# Altium schematic sheet rightinferior.SchDoc
size A
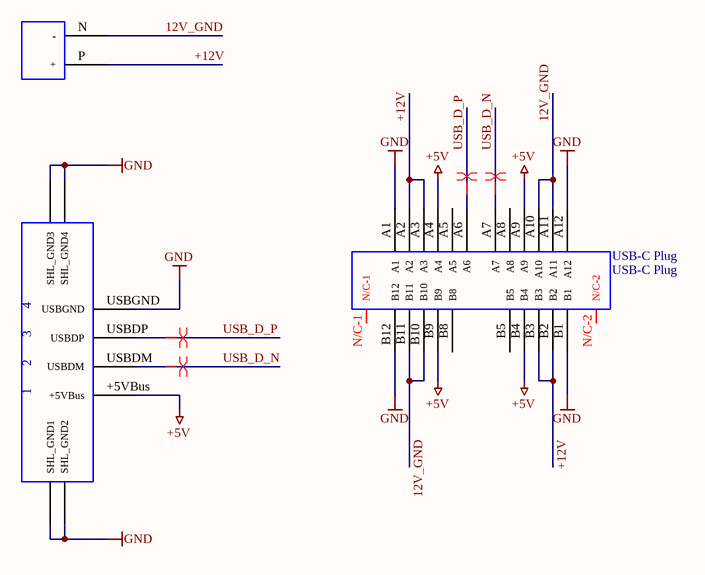
[diagram p0: rightinferior.SchDoc]

## Parts
Screw_Header_-_2_pos  Screw Header - 2 pos  [SCREW HEADER - 2POS]  (value not drawn)
USB-C_Plug  USB-C Plug  [USB C PLUG]
USB_A_Receptacle  USB A Receptacle  [USB A RECEPTACLE]  (value not drawn)

## Nets
+5V: USB-C_Plug.A4 USB-C_Plug.A9 USB-C_Plug.B4 USB-C_Plug.B9 USB_A_Receptacle.+5VBus
GND: USB-C_Plug.A1 USB-C_Plug.A12 USB-C_Plug.B1 USB-C_Plug.B12 USB_A_Receptacle.SHL_GND1 USB_A_Receptacle.SHL_GND2 USB_A_Receptacle.SHL_GND3 USB_A_Receptacle.SHL_GND4 USB_A_Receptacle.USBGND
12V_GND: Screw_Header_-_2_pos.N(-) USB-C_Plug.A10 USB-C_Plug.A11 USB-C_Plug.B10 USB-C_Plug.B11
+12V: Screw_Header_-_2_pos.P(+) USB-C_Plug.A2 USB-C_Plug.A3 USB-C_Plug.B2 USB-C_Plug.B3
USB_D_N: USB-C_Plug.A7 USB_A_Receptacle.USBDM
USB_D_P: USB-C_Plug.A6 USB_A_Receptacle.USBDP

Not connected (* = marked no-connect by the designer): USB-C_Plug A5 A8 B5 B8 N/C-1 N/C-2

## Layout directives
differential pair: USB_D_N, USB_D_P

## Notes on the sheet
- (in symbol USB A Receptacle) 4; 3; 2; 1

## Library data of the parts
Screw_Header_-_2_pos = Screw Header - 2 pos: On Shore Technology - OSTVN02A150; Supplier 1: Digi-Key; Supplier Part Number 1: ED10561-ND
USB-C_Plug = USB-C Plug: Amphenol  - 12401562E4#2A; Supplier 1: Digi-Key; Supplier Part Number 1: 12401562E4#2ACT-ND
USB_A_Receptacle = USB A Receptacle: TE Connectivity AMP Connectors - 1932638-3; Supplier 1: Digi-Key; Supplier Part Number 1: A117902CT-ND